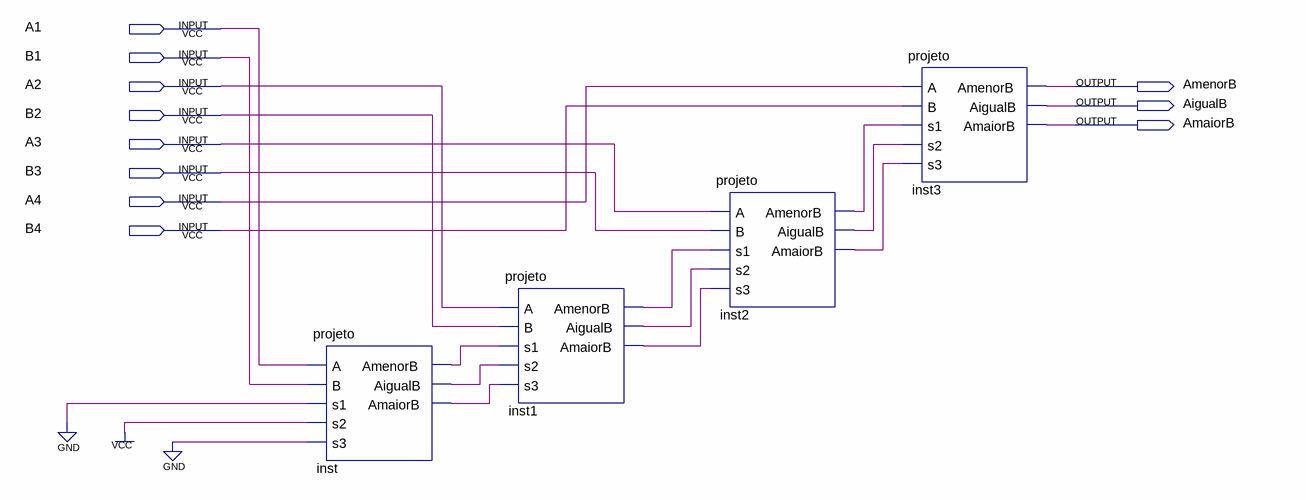
[diagram p0: schematic sheet]
// Quartus schematic tipo1.bdf as structural Verilog: 4 symbols, 11 pins
module tipo1 (
  input  A1,
  input  B1,
  input  A2,
  input  B2,
  input  A3,
  input  B3,
  input  A4,
  input  B4,
  output AmenorB,
  output AigualB,
  output AmaiorB
);

  wire inst1_aigualb, inst1_amaiorb, inst1_amenorb, inst2_aigualb, inst2_amaiorb, inst2_amenorb,
       inst_aigualb, inst_amaiorb, inst_amenorb;

  projeto inst (
    .A(A1), .B(B1), .s1(1'b0), .s2(1'b1), .s3(1'b0), .AmenorB(inst_amenorb), .AigualB(inst_aigualb),
    .AmaiorB(inst_amaiorb));
  projeto inst1 (
    .A(A2), .B(B2), .s1(inst_amenorb), .s2(inst_aigualb), .s3(inst_amaiorb), .AmenorB(inst1_amenorb),
    .AigualB(inst1_aigualb), .AmaiorB(inst1_amaiorb));
  projeto inst2 (
    .A(A3), .B(B3), .s1(inst1_amenorb), .s2(inst1_aigualb), .s3(inst1_amaiorb), .AmenorB(inst2_amenorb),
    .AigualB(inst2_aigualb), .AmaiorB(inst2_amaiorb));
  projeto inst3 (
    .A(A4), .B(B4), .s1(inst2_amenorb), .s2(inst2_aigualb), .s3(inst2_amaiorb), .AmenorB(AmenorB),
    .AigualB(AigualB), .AmaiorB(AmaiorB));
endmodule
